# EAGLE design logger (EAGLE 4.16)
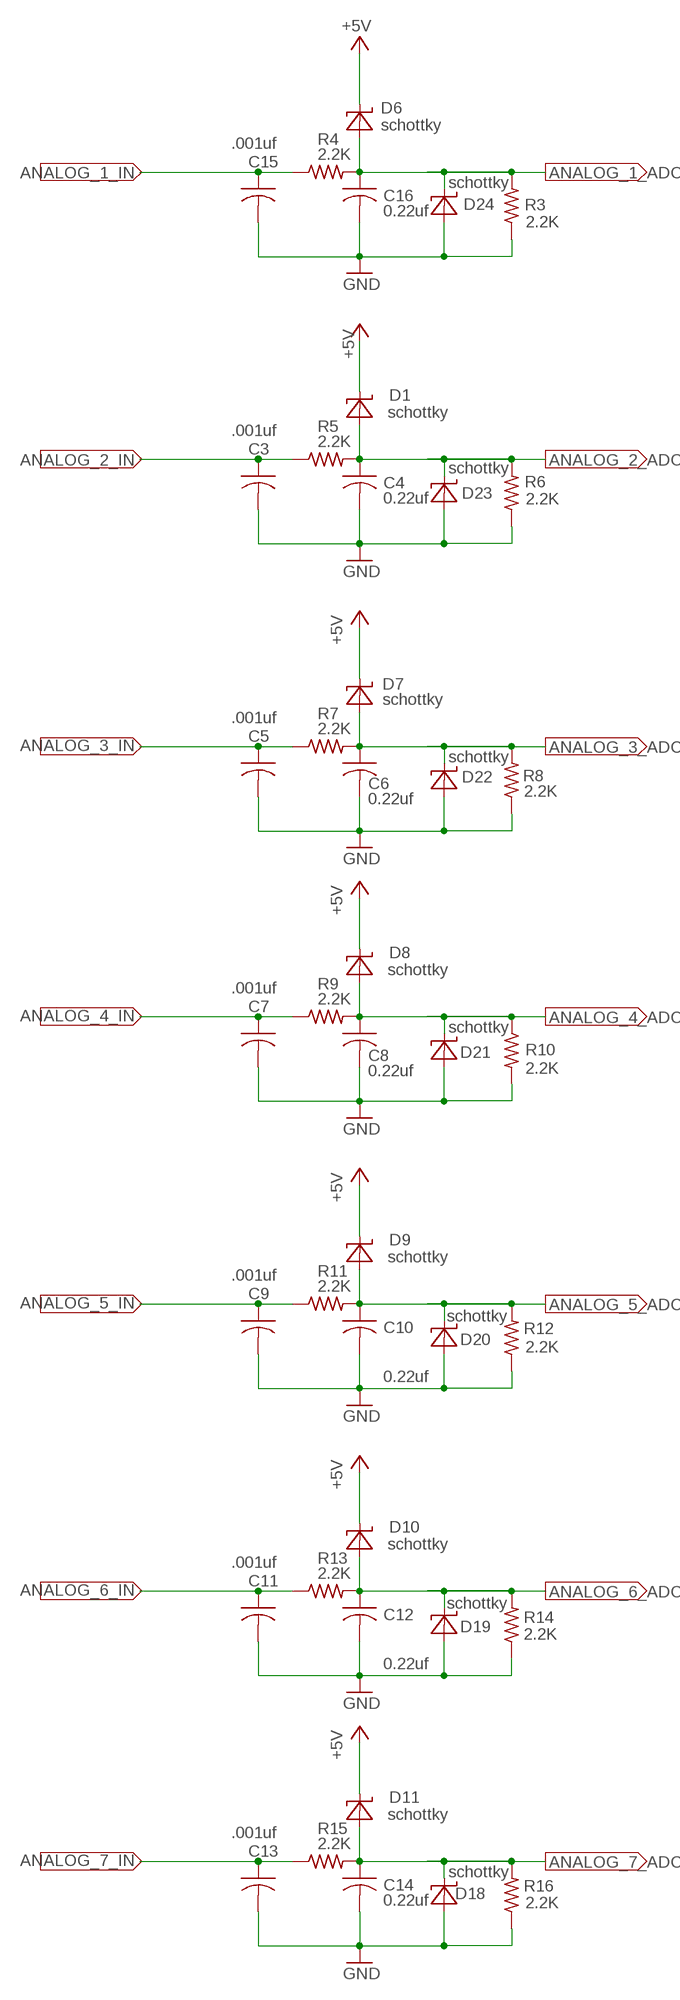
[diagram p0: schematic, sheet 1, part 1 of 2]
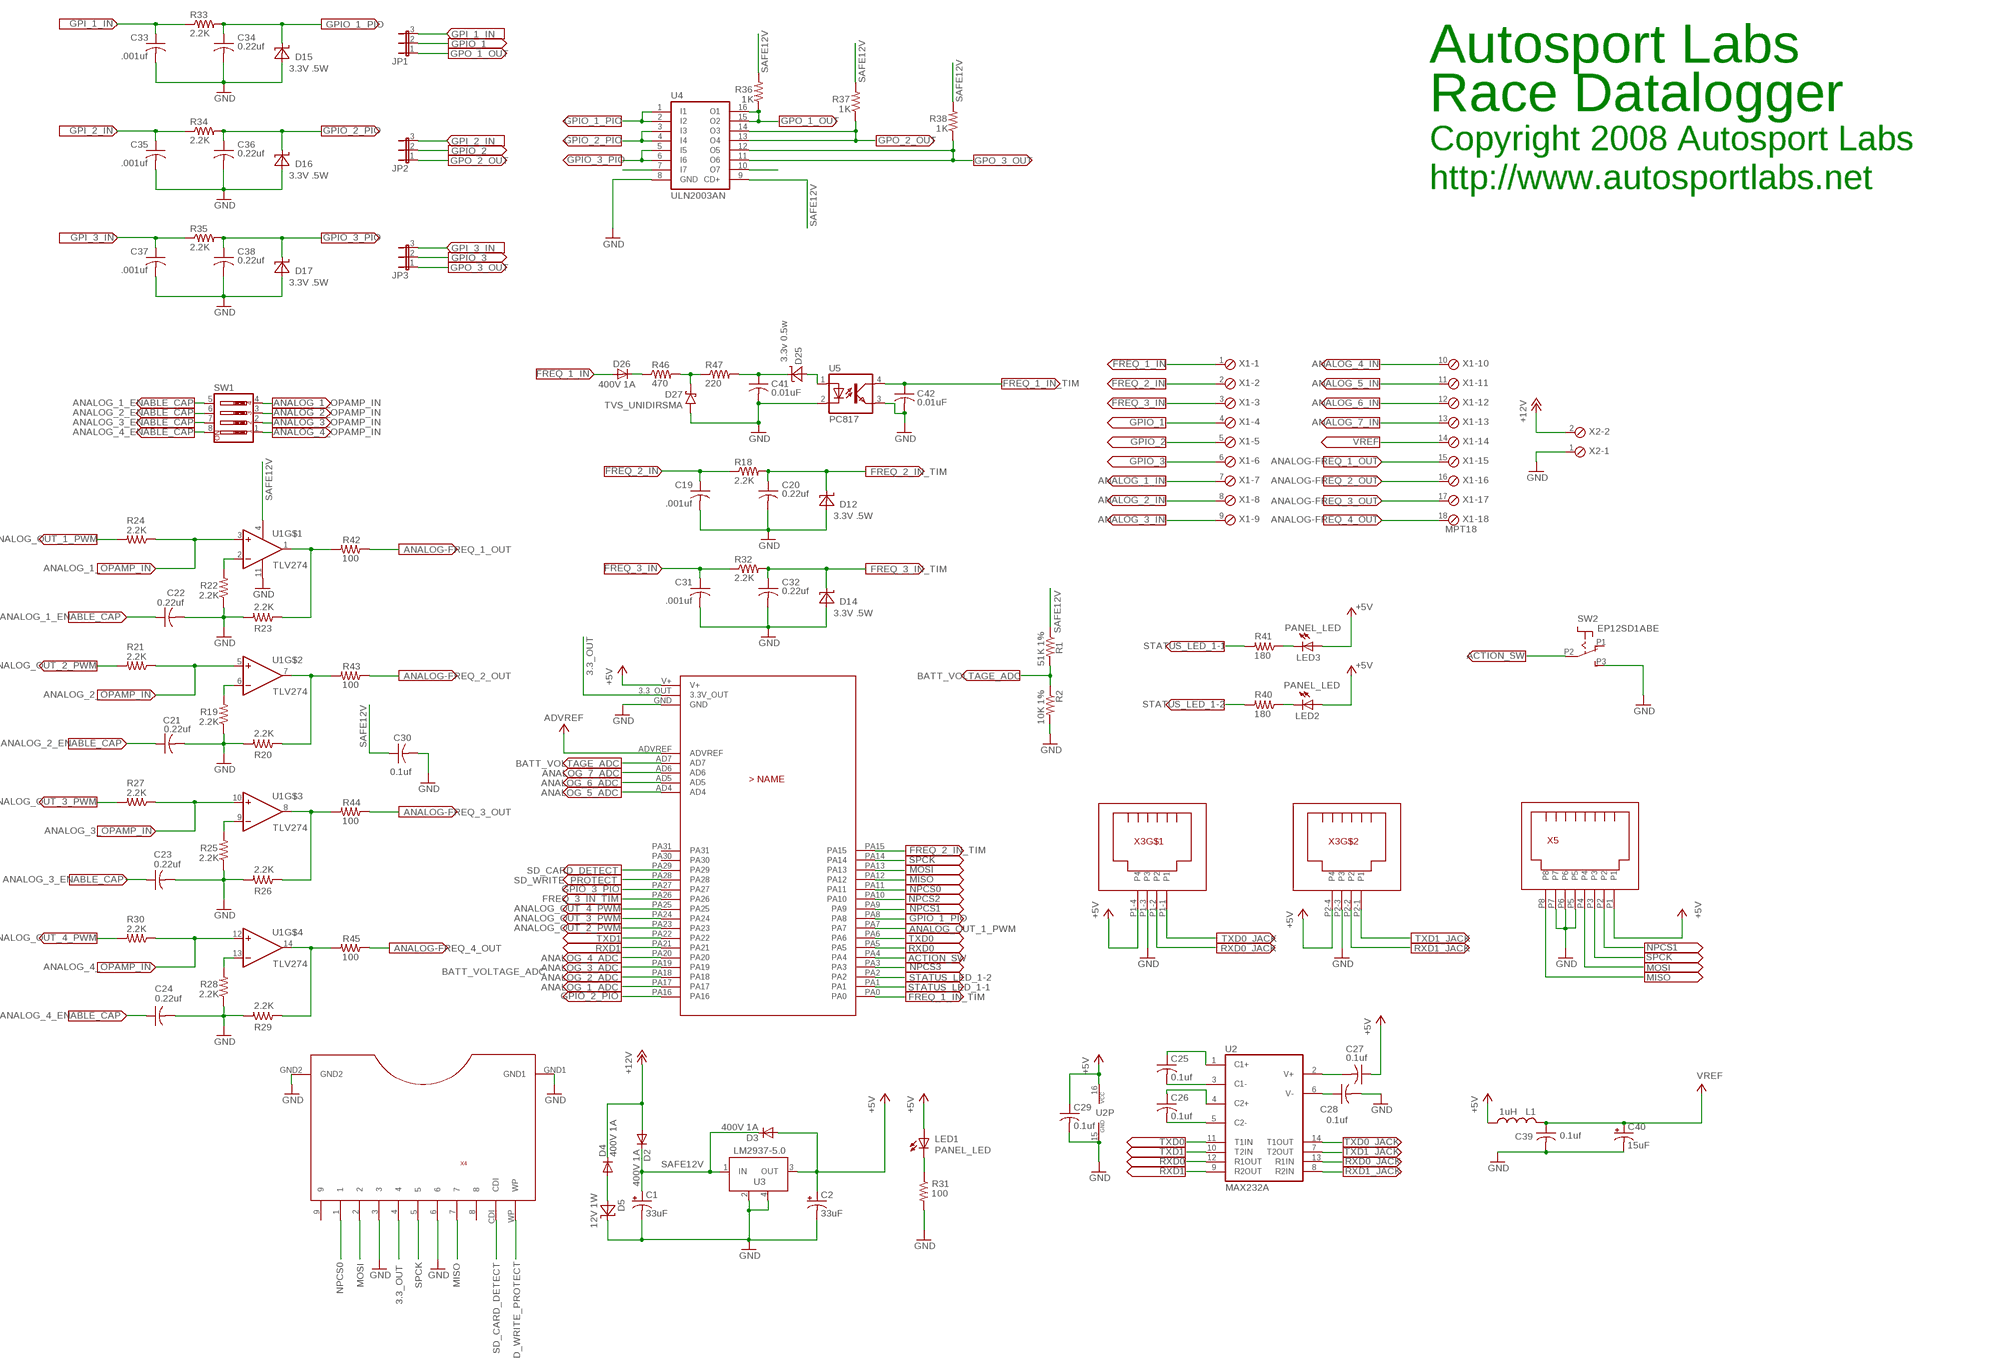
[diagram p1: schematic, sheet 1, part 2 of 2]

## Parts
C1  33uF  CPOL-US153CLV-0605  [153CLV-0605]
C2  33uF  CPOL-USSMCD  [SMC_D]
C3  .001uf  C-USC1206K  [C1206K]
C4  0.22uf  C-USC1206K  [C1206K]
C5  .001uf  C-USC1206K  [C1206K]
C6  0.22uf  C-USC1206K  [C1206K]
C7  .001uf  C-USC1206K  [C1206K]
C8  0.22uf  C-USC1206K  [C1206K]
C9  .001uf  C-USC1206K  [C1206K]
C10  0.22uf  C-USC1206K  [C1206K]
C11  .001uf  C-USC1206K  [C1206K]
C12  0.22uf  C-USC1206K  [C1206K]
C13  .001uf  C-USC1206K  [C1206K]
C14  0.22uf  C-USC1206K  [C1206K]
C15  .001uf  C-USC1206K  [C1206K]
C16  0.22uf  C-USC1206K  [C1206K]
C19  .001uf  C-USC1206K  [C1206K]
C20  0.22uf  C-USC1206K  [C1206K]
C21  0.22uf  C-USC1206K  [C1206K]
C22  0.22uf  C-USC1206K  [C1206K]
C23  0.22uf  C-USC1206K  [C1206K]
C24  0.22uf  C-USC1206K  [C1206K]
C25  0.1uf  C-USC1206K  [C1206K]
C26  0.1uf  C-USC1206K  [C1206K]
C27  0.1uf  C-USC1206K  [C1206K]
C28  0.1uf  C-USC1206K  [C1206K]
C29  0.1uf  C-USC1206K  [C1206K]
C30  0.1uf  C-USC1206K  [C1206K]
C31  .001uf  C-USC1206K  [C1206K]
C32  0.22uf  C-USC1206K  [C1206K]
C33  .001uf  C-USC1206K  [C1206K]
C34  0.22uf  C-USC1206K  [C1206K]
C35  .001uf  C-USC1206K  [C1206K]
C36  0.22uf  C-USC1206K  [C1206K]
C37  .001uf  C-USC1206K  [C1206K]
C38  0.22uf  C-USC1206K  [C1206K]
C39  0.1uf  C-USC1206K  [C1206K]
C40  15uF  CPOL-USSMCD  [SMC_D]
C41  0.01uF  C-USC1206K  [C1206K]
C42  0.01uF  C-USC1206K  [C1206K]
CPU_MODULE  CPU_MODULE  [CPU_MODULE]
D1  schottky  ZENER2  [SOD123]
D2  400V 1A  DIODE1  [SMA]
D3  400V 1A  DIODE1  [SMA]
D4  400V 1A  DIODE1  [SMA]
D5  12V 1W  ZENER2  [SOD123]
D6  schottky  ZENER2  [SOD123]
D7  schottky  ZENER2  [SOD123]
D8  schottky  ZENER2  [SOD123]
D9  schottky  ZENER2  [SOD123]
D10  schottky  ZENER2  [SOD123]
D11  schottky  ZENER2  [SOD123]
D12  3.3V .5W  ZENER2  [SOD123]
D14  3.3V .5W  ZENER2  [SOD123]
D15  3.3V .5W  ZENER2  [SOD123]
D16  3.3V .5W  ZENER2  [SOD123]
D17  3.3V .5W  ZENER2  [SOD123]
D18  schottky  ZENER2  [SOD123]
D19  schottky  ZENER2  [SOD123]
D20  schottky  ZENER2  [SOD123]
D21  schottky  ZENER2  [SOD123]
D22  schottky  ZENER2  [SOD123]
D23  schottky  ZENER2  [SOD123]
D24  schottky  ZENER2  [SOD123]
D25  3.3v 0.5w  ZENER2  [SOD123]
D26  400V 1A  DIODE1  [SMA]
D27  TVS_UNIDIRSMA  [SMA]
JP1  JP2E  [JP2]
JP2  JP2E  [JP2]
JP3  JP2E  [JP2]
L1  1uH  INDUCTOR  [1210]
LED1  PANEL_LED  [RIGHTANGLE_CML_5323F5]
LED2  PANEL_LED  [RIGHTANGLE_CML_5323F5]
LED3  PANEL_LED  [RIGHTANGLE_CML_5323F5]
R1  51K 1%  R-US_M1206  [M1206]
R2  10K 1%  R-US_M1206  [M1206]
R3  2.2K  R-US_M1206  [M1206]
R4  2.2K  R-US_M1206  [M1206]
R5  2.2K  R-US_M1206  [M1206]
R6  2.2K  R-US_M1206  [M1206]
R7  2.2K  R-US_M1206  [M1206]
R8  2.2K  R-US_M1206  [M1206]
R9  2.2K  R-US_M1206  [M1206]
R10  2.2K  R-US_M1206  [M1206]
R11  2.2K  R-US_M1206  [M1206]
R12  2.2K  R-US_M1206  [M1206]
R13  2.2K  R-US_M1206  [M1206]
R14  2.2K  R-US_M1206  [M1206]
R15  2.2K  R-US_M1206  [M1206]
R16  2.2K  R-US_M1206  [M1206]
R18  2.2K  R-US_M1206  [M1206]
R19  2.2K  R-US_M1206  [M1206]
R20  2.2K  R-US_M1206  [M1206]
R21  2.2K  R-US_M1206  [M1206]
R22  2.2K  R-US_M1206  [M1206]
R23  2.2K  R-US_M1206  [M1206]
R24  2.2K  R-US_M1206  [M1206]
R25  2.2K  R-US_M1206  [M1206]
R26  2.2K  R-US_M1206  [M1206]
R27  2.2K  R-US_M1206  [M1206]
R28  2.2K  R-US_M1206  [M1206]
R29  2.2K  R-US_M1206  [M1206]
R30  2.2K  R-US_M1206  [M1206]
R31  100  R-US_M1206  [M1206]
R32  2.2K  R-US_M1206  [M1206]
R33  2.2K  R-US_M1206  [M1206]
R34  2.2K  R-US_M1206  [M1206]
R35  2.2K  R-US_M1206  [M1206]
R36  1K  R-US_M1206  [M1206]
R37  1K  R-US_M1206  [M1206]
R38  1K  R-US_M1206  [M1206]
R40  180  R-US_M1206  [M1206]
R41  180  R-US_M1206  [M1206]
R42  100  R-US_M1206  [M1206]
R43  100  R-US_M1206  [M1206]
R44  100  R-US_M1206  [M1206]
R45  100  R-US_M1206  [M1206]
R46  470  R-US_M1206  [M1206]
R47  220  R-US_M1206  [M1206]
SW1  SW_DIP-4  [EDG-04]
SW2  EP12SD1ABE  [EP12SD1ABE]
U1  TLV274  [DIL14]
U2  MAX232A  MAX232  [DIL16]
U3  LM2937-5.0  LM2937  [SOT223]
U4  ULN2003AN  [DIL16]
U5  PC817  [DIL04]
X1  MPT18  [18POL35]
X2  MPT23.5MM  [2POL35]
X3  GENERIC_DUAL_RJ11  [DUAL_RJ11_RIGHT_ANGLE_PCB]
X4  3M-CARD_CONNECTOR_SD  [SD_CARD]
X5  RJ45_RIGHT_ANGLE  [RJ45_RIGHT_ANGLE_PCB]

## Nets
3.3_OUT: CPU_MODULE.3.3_OUT(3.3V_OUT) X4.4
+5V: C2.+ C27.1 C29.1 CPU_MODULE.V+ D1.C D3.A D6.C D7.C D8.C D9.C D10.C D11.C L1.1 LED1.A LED2.A LED3.A U2.16(VCC) U3.3(OUT) X3.P1-4(P4) X3.P2-4(P4) X5.P1
+12V: D2.A D4.C X2.2
ACTION_SW: CPU_MODULE.PA4 SW2.P2(P)
ADVREF: CPU_MODULE.ADVREF
ANALOG-FREQ_1_OPAMP_OUT: R23.1 R42.2 U1.1(OUT)
ANALOG-FREQ_1_OUT: R42.1 X1.15
ANALOG-FREQ_2_OPAMP_OUT: R20.1 R43.2 U1.7(OUT)
ANALOG-FREQ_2_OUT: R43.1 X1.16
ANALOG-FREQ_3_OPAMP_OUT: R26.1 R44.2 U1.8(OUT)
ANALOG-FREQ_3_OUT: R44.1 X1.17
ANALOG-FREQ_4_OPAMP_OUT: R29.1 R45.2 U1.14(OUT)
ANALOG-FREQ_4_OUT: R45.1 X1.18
ANALOG_1_ADC: C16.1 CPU_MODULE.PA17 D6.A D24.C R3.2 R4.2
ANALOG_1_ENABLE_CAP: C22.1 SW1.5
ANALOG_1_IN: C15.1 R4.1 X1.7
ANALOG_1_OPAMP_IN: R24.1 SW1.4 U1.3(+IN)
ANALOG_2_ADC: C4.1 CPU_MODULE.PA18 D1.A D23.C R5.2 R6.2
ANALOG_2_ENABLE_CAP: C21.1 SW1.6
ANALOG_2_IN: C3.1 R5.1 X1.8
ANALOG_2_OPAMP_IN: R21.1 SW1.3 U1.5(+IN)
ANALOG_3_ADC: C6.1 CPU_MODULE.PA19 D7.A D22.C R7.2 R8.2
ANALOG_3_ENABLE_CAP: C23.1 SW1.7
ANALOG_3_IN: C5.1 R7.1 X1.9
ANALOG_3_OPAMP_IN: R27.1 SW1.2 U1.10(+IN)
ANALOG_4_ADC: C8.1 CPU_MODULE.PA20 D8.A D21.C R9.2 R10.1
ANALOG_4_ENABLE_CAP: C24.1 SW1.8
ANALOG_4_IN: C7.1 R9.1 X1.10
ANALOG_4_OPAMP_IN: R30.1 SW1.1 U1.12(+IN)
ANALOG_5_ADC: C10.1 CPU_MODULE.AD4 D9.A D20.C R11.2 R12.2
ANALOG_5_IN: C9.1 R11.1 X1.11
ANALOG_6_ADC: C12.1 CPU_MODULE.AD5 D10.A D19.C R13.2 R14.2
ANALOG_6_IN: C11.1 R13.1 X1.12
ANALOG_7_ADC: C14.1 CPU_MODULE.AD6 D11.A D18.C R15.2 R16.2
ANALOG_7_IN: C13.1 R15.1 X1.13
ANALOG_OUT_1_PWM: CPU_MODULE.PA7 R24.2
ANALOG_OUT_2_PWM: CPU_MODULE.PA23 R21.2
ANALOG_OUT_3_PWM: CPU_MODULE.PA24 R27.2
ANALOG_OUT_4_PWM: CPU_MODULE.PA25 R30.2
BATT_VOLTAGE_ADC: CPU_MODULE.AD7 R1.2 R2.1
FREQ_1_IN: D26.A X1.1
FREQ_1_IN_TIM: C42.1 CPU_MODULE.PA0 U5.4(COL)
FREQ_2_IN: C19.1 R18.1 X1.2
FREQ_2_IN_TIM: C20.1 CPU_MODULE.PA15 D12.C R18.2
FREQ_3_IN: C31.1 R32.1 X1.3
FREQ_3_IN_TIM: C32.1 CPU_MODULE.PA26 D14.C R32.2
GND: C1.- C2.- C3.2 C4.2 C5.2 C6.2 C7.2 C8.2 C9.2 C10.2 C11.2 C12.2 C13.2 C14.2 C15.2 C16.2 C19.2 C20.2 C21.2 C22.2 C23.2 C24.2 C28.2 C29.2 C30.2 C31.2 C32.2 C33.2 C34.2 C35.2 C36.2 C37.2 C38.2 C39.2 C40.- C41.2 C42.2 CPU_MODULE.GND D5.C D12.A D14.A D15.A D16.A D17.A D18.A D19.A D20.A D21.A D22.A D23.A D24.A D27.A R2.2 R3.1 R6.1 R8.1 R10.2 R12.1 R14.1 R16.1 R19.1 R20.2 R22.1 R23.2 R25.1 R26.2 R28.1 R29.2 R31.2 SW2.P3(S) U1.11(V-) U2.15(GND) U3.2(GND) U3.4(GND_TAB) U4.8(GND) U5.2(C) U5.3(EMIT) X2.1 X3.P1-3(P3) X3.P2-3(P3) X4.3 X4.6 X4.GND1 X4.GND2 X5.P5 X5.P6 X5.P7
GPI_1_IN: C33.1 JP1.3 R33.1
GPI_2_IN: C35.1 JP2.3 R34.1
GPI_3_IN: C37.1 JP3.3 R35.1
GPIO_1: JP1.2 X1.4
GPIO_1_PIO: C34.1 CPU_MODULE.PA8 D15.C R33.2 U4.1(I1) U4.2(I2)
GPIO_2: JP2.2 X1.5
GPIO_2_PIO: C36.1 CPU_MODULE.PA16 D16.C R34.2 U4.3(I3) U4.4(I4)
GPIO_3: JP3.2 X1.6
GPIO_3_PIO: C38.1 CPU_MODULE.PA27 D17.C R35.2 U4.5(I5) U4.6(I6)
GPO_1_OUT: JP1.1 R36.1 U4.15(O2) U4.16(O1)
GPO_2_OUT: JP2.1 R37.1 U4.13(O4) U4.14(O3)
GPO_3_OUT: JP3.1 R38.1 U4.11(O6) U4.12(O5)
MISO: CPU_MODULE.PA12 X4.7 X5.P8
MOSI: CPU_MODULE.PA13 X4.2 X5.P4
N$3: D27.C R46.2 R47.1
N$4: D26.C R46.1
N$5: D4.A D5.A
N$6: C41.1 D25.C R47.2
N$7: LED3.C R41.1
N$8: R19.2 U1.6(-IN)
N$9: LED2.C R40.1
N$10: R22.2 U1.2(-IN)
N$12: R25.2 U1.9(-IN)
N$14: R28.2 U1.13(-IN)
N$15: D25.A U5.1(A)
N$16: C25.1 U2.1(C1+)
N$17: C25.2 U2.3(C1-)
N$18: C26.1 U2.4(C2+)
N$19: C26.2 U2.5(C2-)
N$20: C27.2 U2.2(V+)
N$21: C28.1 U2.6(V-)
N$22: LED1.C R31.1
N$30: U4.10(O7)
N$37: U4.7(I7)
NPCS0: CPU_MODULE.PA11 X4.1
NPCS1: CPU_MODULE.PA9 X5.P2
NPCS2: CPU_MODULE.PA10
NPCS3: CPU_MODULE.PA3
RXD0: CPU_MODULE.PA5 U2.12(R1OUT)
RXD0_JACK: U2.13(R1IN) X3.P1-2(P2)
RXD1: CPU_MODULE.PA21 U2.9(R2OUT)
RXD1_JACK: U2.8(R2IN) X3.P2-2(P2)
SAFE12V: C1.+ C30.1 D2.C D3.C R1.1 R36.2 R37.2 R38.2 U1.4(V+) U3.1(IN) U4.9(CD+)
SD_CARD_DETECT: CPU_MODULE.PA29 X4.CDI
SD_WRITE_PROTECT: CPU_MODULE.PA28 X4.WP
SPCK: CPU_MODULE.PA14 X4.5 X5.P3
STATUS_LED_1-1: CPU_MODULE.PA1 R41.2
STATUS_LED_1-2: CPU_MODULE.PA2 R40.2
TXD0: CPU_MODULE.PA6 U2.11(T1IN)
TXD0_JACK: U2.14(T1OUT) X3.P1-1(P1)
TXD1: CPU_MODULE.PA22 U2.10(T2IN)
TXD1_JACK: U2.7(T2OUT) X3.P2-1(P1)
VREF: C39.1 C40.+ L1.2 X1.14
Unconnected: CPU_MODULE.PA30 CPU_MODULE.PA31 SW2.P1(O) X4.8 X4.9

## Notes on the sheet
- Autosport Labs
- Race Datalogger
- Copyright 2008 Autosport Labs
- http://www.autosportlabs.net

## Library data of the parts
C1 C2 C40 = rcl:CPOL-US: POLARIZED CAPACITOR, American symbol
C3-C16 C19-C39 C41 C42 = rcl:C-US: CAPACITOR, American symbol
CPU_MODULE = cpu_module:CPU_MODULE
D1 D5-D12 D14-D25 = smt_diodes:ZENER
D2-D4 D26 = smt_diodes:DIODE
D27 = smt_diodes:TVS_UNIDIR
JP1-JP3 = jumper:JP2E: JUMPER
L1 = smt_inductors:INDUCTOR
LED1-LED3 = LEDs:PANEL_LED
R1-R16 R18-R38 R40-R47 = rcl:R-US_: RESISTOR, American symbol
SW1 = special:SW_DIP-4: DIP SWITCH
SW2 = misc_switch:EP12SD1ABE
U1 = op_amps:TLV274
U2 = maxim:MAX232: RS232 TRANSEIVER
U3 = voltage_regulators:LM2937
U4 = uln-udn:ULN2003A: DRIVER ARRAY
U5 = optocoupler:PC817: SHARP OPTO COUPLER
X1 = pluggable_terminal_blocks:MPT18
X2 = pluggable_terminal_blocks:MPT2: PHOENIX CONNECTOR
X3 = FCI_RJ12:GENERIC_DUAL_RJ11
X4 = 3m_sd_card:3M-CARD_CONNECTOR_SD
X5 = FCI_RJ12:RJ45_RIGHT_ANGLE

## Board
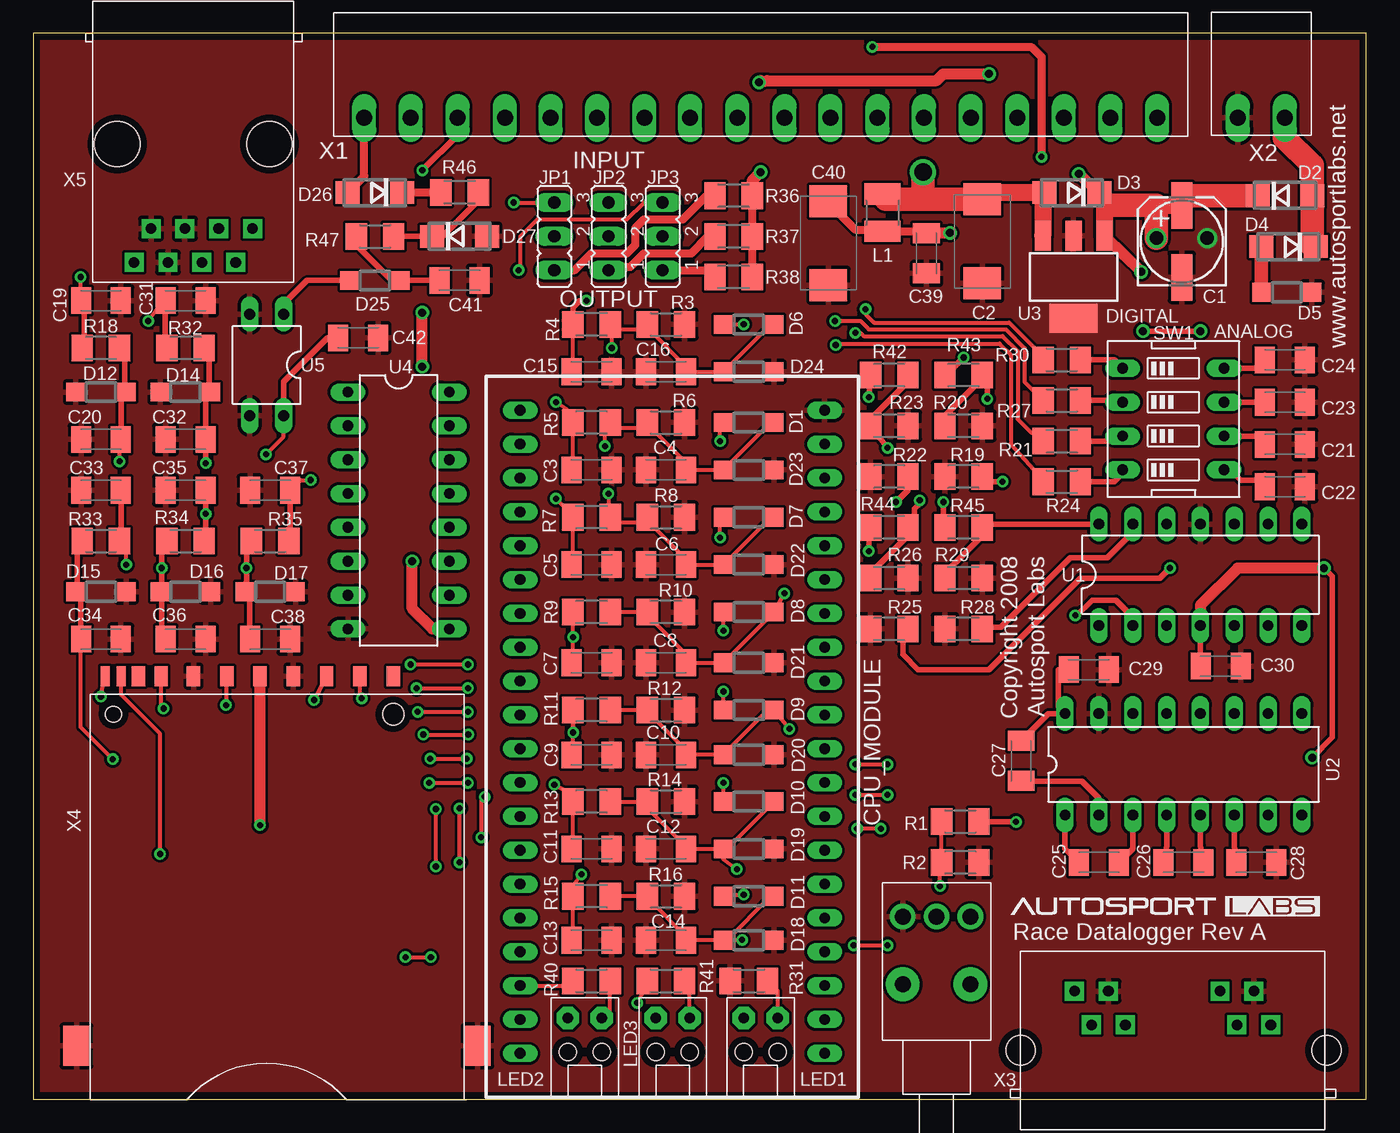
[diagram p2: board, top side]
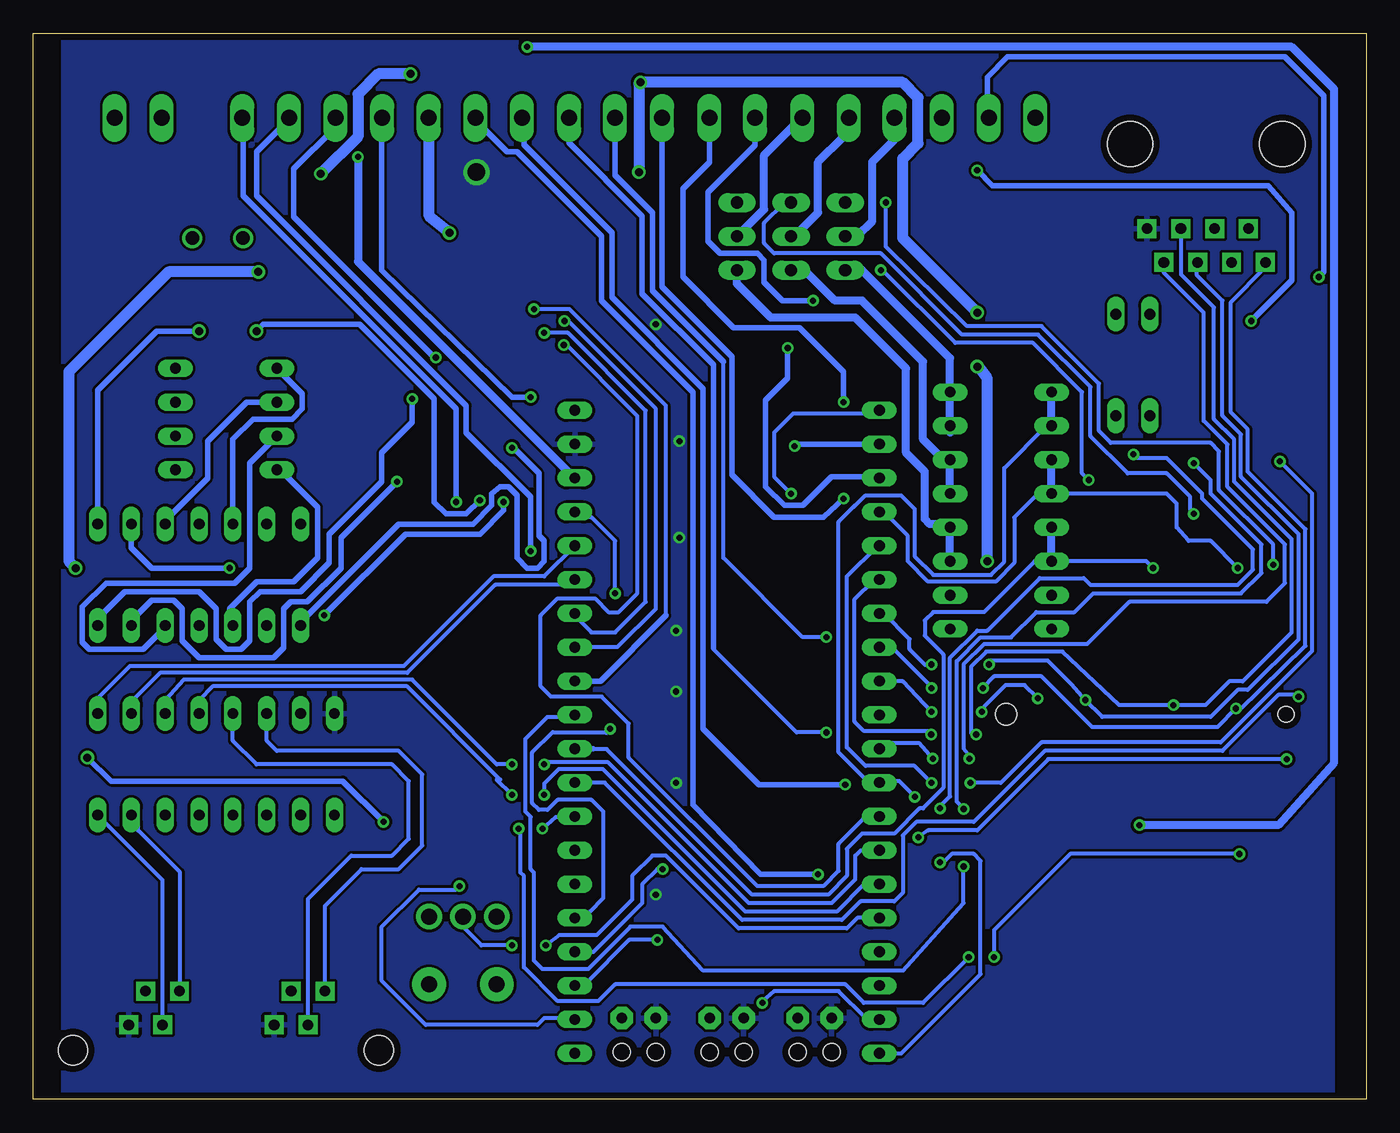
[diagram p3: board, bottom side, seen from below]

Size 100.08 x 80.01 mm. Coordinates in mm from the lower left corner, seen from the top.
Outline: 0,0 100.08,0 100.08,80.01 0,80.01 0,0
Copper layers (1*16): Top 0.035mm / dielectric 1.5mm / Bottom 0.035mm
Design rules "default": minimum track width 10mil, minimum drill 17mil, track to track 8mil, track to pad 8mil, pad to pad 8mil, via to via 8mil, smd to smd 8mil, copper to edge 20mil, drill to drill 8mil, minimum pad ring 10mil, minimum via ring 8mil, stop-mask expansion 4mil, vias tented up to drill 24mil, thermal gap 10mil

### Footprints (pad centres in the part's own frame; a part is rotated, then mirrored left to right if it is on the bottom)
153CLV-0605 = smd 3.5 x 1.6: + 2.7,0; - -2.7,0
SMC_D = smd 2.4 x 2.8: + -3.15,0; - 3.15,0
C1206K = smd 1.5 x 2: 1 -1.5,0; 2 1.5,0
CPU_MODULE = drill 0.8 long: 3.3_OUT -20.32,12.7; AD4 12.7,12.7; AD5 15.24,12.7; AD6 17.78,12.7; AD7 20.32,12.7; ADVREF 22.86,12.7; GND -25.4,12.7; PA0 22.86,-10.16; PA1 20.32,-10.16; PA2 17.78,-10.16; PA3 15.24,-10.16; PA4 12.7,-10.16; PA5 10.16,-10.16; PA6 7.62,-10.16; PA7 5.08,-10.16; PA8 2.54,-10.16; PA9 0,-10.16; PA10 -2.54,-10.16; PA11 -5.08,-10.16; PA12 -7.62,-10.16; PA13 -10.16,-10.16; PA14 -12.7,-10.16; PA15 -15.24,-10.16; PA16 -17.78,-10.16; PA17 -20.32,-10.16; PA18 -22.86,-10.16; PA19 -25.4,-10.16; PA20 -17.78,12.7; PA21 -15.24,12.7; PA22 -12.7,12.7; PA23 -10.16,12.7; PA24 -7.62,12.7; PA25 -5.08,12.7; PA26 -2.54,12.7; PA27 0,12.7; PA28 2.54,12.7; PA29 5.08,12.7; PA30 7.62,12.7; PA31 10.16,12.7; V+ -22.86,12.7
SOD123 = smd 1.4 x 1.4: A 1.9,0; C -1.9,0
SMA = smd 1.8 x 1.7: A 2.05,0; C -2.05,0
JP2 = drill 0.914 long: 1 -2.54,0; 2 0,0; 3 2.54,0
1210 = smd 1.6 x 2.7: 1 -1.4,0; 2 1.4,0
RIGHTANGLE_CML_5323F5 = drill 0.8 pad 1.676 octagon: A -1.27,1.651; C 1.27,1.651 | hole 1.295: 1.27,-0.889; -1.27,-0.889
M1206 = smd 1.6 x 2: 1 -1.4,0; 2 1.4,0
EDG-04 = drill 0.813 long: 1 -3.81,-3.81; 2 -1.27,-3.81; 3 1.27,-3.81; 4 3.81,-3.81; 5 3.81,3.81; 6 1.27,3.81; 7 -1.27,3.81; 8 -3.81,3.81
EP12SD1ABE = drill 1.194 pad 2.54 round: BRACKET1 -2.54,-5.08; BRACKET2 2.54,-5.08 | drill 1.194 pad 1.93 round: P1 2.54,0; P2 0,0; P3 -2.54,0
DIL14 = drill 0.813 long: 1 -7.62,-3.81; 2 -5.08,-3.81; 3 -2.54,-3.81; 4 0,-3.81; 5 2.54,-3.81; 6 5.08,-3.81; 7 7.62,-3.81; 8 7.62,3.81; 9 5.08,3.81; 10 2.54,3.81; 11 0,3.81; 12 -2.54,3.81; 13 -5.08,3.81; 14 -7.62,3.81
DIL16 = drill 0.813 long: 1 -8.89,-3.81; 2 -6.35,-3.81; 3 -3.81,-3.81; 4 -1.27,-3.81; 5 1.27,-3.81; 6 3.81,-3.81; 7 6.35,-3.81; 8 8.89,-3.81; 9 8.89,3.81; 10 6.35,3.81; 11 3.81,3.81; 12 1.27,3.81; 13 -1.27,3.81; 14 -3.81,3.81; 15 -6.35,3.81; 16 -8.89,3.81
SOT223 = smd 1.219 x 2.235: 1 -2.311,-3.099; 2 0,-3.099; 3 2.311,-3.099 | smd 3.6 x 2.2: 4 0,3.099
DIL04 = drill 0.813 long: 1 -1.27,-3.81; 2 1.27,-3.81; 3 1.27,3.81; 4 -1.27,3.81
18POL35 = drill 1.2 long: 1 -29.77,0; 2 -26.28,0; 3 -22.74,0; 4 -19.2,0; 5 -15.76,0; 6 -12.27,0; 7 -8.73,0; 8 -5.29,0; 9 -1.75,0; 10 1.79,0; 11 5.23,0; 12 8.77,0; 13 12.27,0; 14 15.77,0; 15 19.27,0; 16 22.77,0; 17 26.27,0; 18 29.77,0
2POL35 = drill 1.2 long: 1 -1.76,0; 2 1.77,0
DUAL_RJ11_RIGHT_ANGLE_PCB = drill 0.8 pad 1.422 square: P1-1 4.064,10.414; P1-2 5.334,7.874; P1-3 6.604,10.414; P1-4 7.874,7.874; P2-1 14.986,10.414; P2-2 16.256,7.874; P2-3 17.526,10.414; P2-4 18.796,7.874 | hole 2.2: 22.987,5.969; 0,5.969
SD_CARD = smd 1 x 1.5: 1 7,2.8; 2 4.5,2.8; 3 2,2.8; 4 -0.5,2.8; 5 -3,2.8; 6 -5.5,2.8; 7 -7.93,2.8; 8 -9.63,2.8; 9 9.5,2.8 | smd 0.7 x 1.5: CDI -10.93,2.8; WP -12.13,2.8 | smd 2 x 3: GND1 -14.28,-24.95; GND2 15.82,-24.95 | hole 1.6: 9.5,-0.05 | hole 1.2: -11.5,-0.05
RJ45_RIGHT_ANGLE_PCB = drill 0.8 pad 1.422 square: P1 3.099,17.069; P2 4.369,19.609; P3 5.639,17.069; P4 6.909,19.609; P5 8.179,17.069; P6 9.449,19.609; P7 10.719,17.069; P8 11.989,19.609 | hole 3.404: 1.829,10.719; 13.259,10.719

### Placement (x,y rotation side)
C1  86.23,64.39 90 top
C2  71.25,64.39 270 top
C3  41.91,47.24 0 top
C4  47.5,47.24 180 top
C5  41.91,40.13 0 top
C6  47.5,40.13 180 top
C7  41.91,32.77 0 top
C8  47.5,32.77 180 top
C9  41.91,25.86 0 top
C10  47.5,25.86 180 top
C11  41.91,18.8 0 top
C12  47.5,18.8 180 top
C13  41.91,11.94 0 top
C14  47.5,11.94 180 top
C15  41.91,54.61 0 top
C16  47.5,54.61 180 top
C19  5.08,59.94 0 top
C20  5.08,49.53 180 top
C21  93.98,49.15 0 top
C22  93.98,45.97 0 top
C23  93.98,52.32 0 top
C24  93.98,55.5 0 top
C25  80.01,17.78 0 top
C26  86.36,17.78 0 top
C27  74.17,25.4 270 top
C28  91.82,17.78 0 top
C29  79.25,32.26 0 top
C30  89.15,32.51 0 top
C31  11.43,59.94 0 top
C32  11.43,49.53 180 top
C33  5.08,45.72 180 top
C34  5.08,34.54 0 top
C35  11.43,45.72 180 top
C36  11.43,34.54 0 top
C37  17.78,45.72 180 top
C38  17.78,34.54 0 top
C39  67.06,63.5 270 top
C40  59.69,64.26 270 top
C41  32,61.47 0 top
C42  24.38,57.15 0 top
CPU_MODULE  46.71,26.31 270 top
D1  53.72,50.8 0 top
D2  93.98,67.82 0 top
D3  77.98,68.07 180 top
D4  94.23,64.01 180 top
D5  94.11,60.58 180 top
D6  53.72,58.17 0 top
D7  53.72,43.69 0 top
D8  53.72,36.58 0 top
D9  53.72,29.21 0 top
D10  53.72,22.35 0 top
D11  53.72,15.24 0 top
D12  5.08,53.09 180 top
D14  11.43,53.09 180 top
D15  5.08,38.1 0 top
D16  11.43,38.1 0 top
D17  17.78,38.1 0 top
D18  53.72,11.94 0 top
D19  53.72,18.8 0 top
D20  53.72,25.86 0 top
D21  53.72,32.77 0 top
D22  53.72,40.13 0 top
D23  53.72,47.24 0 top
D24  53.72,54.61 0 top
D25  25.65,61.47 180 top
D26  25.65,68.07 180 top
D27  32,64.77 0 top
JP1  39.12,64.77 90 top
JP2  43.18,64.77 90 top
JP3  47.24,64.77 90 top
L1  63.75,66.55 270 top
LED1  54.61,4.45 0 top
LED2  41.4,4.45 0 top
LED3  48.01,4.45 0 top
R1  69.6,20.85 180 top
R2  69.6,17.78 0 top
R3  47.5,58.17 180 top
R4  41.91,58.17 0 top
R5  41.91,50.8 0 top
R6  47.5,50.8 180 top
R7  41.91,43.69 0 top
R8  47.5,43.69 180 top
R9  41.91,36.58 0 top
R10  47.5,36.58 0 top
R11  41.91,29.21 0 top
R12  47.5,29.21 180 top
R13  41.91,22.35 0 top
R14  47.5,22.35 180 top
R15  41.91,15.24 0 top
R16  47.5,15.24 180 top
R18  5.08,56.39 0 top
R19  69.85,46.74 0 top
R20  69.85,50.55 0 top
R21  77.22,49.4 180 top
R22  64.26,46.74 0 top
R23  64.26,50.55 0 top
R24  77.22,46.35 180 top
R25  64.26,35.31 0 top
R26  64.26,39.12 0 top
R27  77.22,52.45 180 top
R28  69.85,35.31 0 top
R29  69.85,39.12 0 top
R30  77.22,55.5 180 top
R31  53.72,8.89 180 top
R32  11.43,56.39 0 top
R33  5.08,41.91 180 top
R34  11.43,41.91 180 top
R35  17.78,41.91 180 top
R36  52.58,67.82 0 top
R37  52.58,64.77 0 top
R38  52.58,61.72 0 top
R40  41.91,8.89 180 top
R41  47.5,8.89 180 top
R42  64.26,54.36 0 top
R43  69.85,54.36 0 top
R44  64.26,42.93 0 top
R45  69.85,42.93 0 top
R46  32,68.07 0 top
R47  25.65,64.77 180 top
SW1  85.6,51.05 270 top
SW2  67.82,13.72 0 top
U1  87.63,39.37 0 top
U2  86.36,25.15 0 top
U3  78.11,61.72 180 top
U4  27.43,44.2 270 top
U5  17.53,55.12 180 top
X1  54.61,73.66 0 top
X2  92.2,73.66 0 top
X3  74.12,-2.29 0 top
X4  17.53,28.96 0 top
X5  19.56,82.42 180 top

### Tracks (layer width: path | path; a pad name or v marks a point on that pad's centre or on a via)
3.3_OUT  (via drill 0.46)
  Top 0.61: v75.69,70.74 75.69,78.23 74.93,78.99 v62.99,78.99
  Top 0.813: X4.4 17.03,20.58 v17.02,20.57
  Bottom 0.61: v17.02,20.57 6.6,20.57 2.41,25.27 2.41,75.82 5.59,78.99 v62.99,78.99 | v75.69,70.74 75.69,62.87 59.56,46.74 59.31,46.74 59.44,46.66 CPU_MODULE.3.3_OUT
+5V  (via drill 0.46, 1.3)
  Top 0.305: D11.C 51.82,15.36 v53.34,15.37 | 51.82,24 v51.82,23.75 D10.C | D9.C v51.82,30.61 | D8.C 51.82,35.06 v51.82,35.18 | D7.C 51.56,43.43 v51.56,42.16 | D1.C 51.56,50.54 v51.56,49.4 | D6.C v53.34,58.17
  Top 0.406: C29.1 76.96,32.23 76.96,29.46 U2.16 76.22,28.96 C27.1
  Top 1.27: U3.3 75.79,67.92 75.95,68.07 D3.A 71.63,68.07 71.12,67.56 71.14,67.54 C2.+ | L1.1 63.75,67.82 64.01,67.56
  Top 1.778: 64.01,67.56 66.8,67.56 | 66.8,67.56 71.12,67.56 | 66.8,67.56 v66.8,69.6
  pour Bottom: 2.54,79.5 2.54,0.51 97.79,0.51 97.79,79.5
+12V
  Top 1.27: D4.C 96.01,64.01 96.03,64.03 | D2.A 96.01,67.82 | 93.93,73.7 93.93,73.97 | 93.93,73.7 X2.2 | 93.93,72.19 93.93,73.7
  Top 1.778: 96.03,64.03 D2.A | 96.01,67.82 96.01,70.1 93.93,72.19
ACTION_SW  (via drill 0.46)
  Top 0.305: v61.59,11.56 v64.14,11.56
  Bottom 0.305: CPU_MODULE.PA4 38.2,13.61 38.99,12.83 47.12,12.83 52.58,18.29 53.59,18.29 55.12,16.76 55.12,14.99 57.78,12.32 60.58,12.32 v61.59,11.56 | v64.14,11.56 66.42,11.56 67.82,12.95 SW2.P2
ANALOG-FREQ_1_OPAMP_OUT  (via drill 0.46)
  Top 0.406: R23.1 62.74,50.55 | R42.2 65.66,53.85 62.87,51.05 | R23.1 62.61,51.3 62.87,51.05 | R23.1 62.87,51.05 | 62.87,51.05 62.36,51.05 | R23.1 62.87,50.67 | R23.1 | v64.14,48.9 R23.1
  Bottom 0.406: U1.1 80.01,35.81 72.64,43.18 67.06,43.18 65.66,44.58 65.66,45.47 65.02,45.97 64.39,45.97 63.75,45.34 63.75,40.64 62.99,39.88 62.23,39.88 61.72,40.39 61.72,41.91 62.1,42.29 62.1,46.99 64.01,48.9 v64.14,48.9
ANALOG-FREQ_1_OUT  (via drill 0.46)
  Top 0.406: R42.1 62.48,54.36 | 62.99,54.61 62.99,54.36 R42.1 | R42.1 62.87,54.23 v62.74,52.7
  Bottom 0.406: X1.15 73.91,73.66 73.91,62.23 64.14,52.7 v62.74,52.7
ANALOG-FREQ_2_OPAMP_OUT  (via drill 0.46)
  Top 0.406: R20.1 68.2,50.8 68.07,50.93 71,53.85 R43.2 70.99,54.36 71.63,53.72 v71.63,52.58
  Bottom 0.406: U1.7 95.25,36.07 93.22,38.1 87.63,38.1 86.36,36.83 86.36,34.54 85.6,33.78 84.45,33.78 83.82,34.42 83.82,37.34 83.06,38.1 80.01,38.1 77.85,40.26 77.85,42.42 73.91,46.35 73.91,48.51 71.63,50.8 v71.63,52.58
ANALOG-FREQ_2_OUT  (via drill 0.46)
  Top 0.406: 68.71,54.61 R43.1 68.45,54.48 68.71,54.23 68.76,54.59 v69.85,55.68
  Bottom 0.406: v69.85,55.68 69.98,55.7 80.52,66.24 80.52,69.85 77.47,72.9 77.47,73.91 77.38,73.82 X1.16 77.47,73.66
ANALOG-FREQ_3_OPAMP_OUT  (via drill 0.46, 0.6)
  Top 0.406: 65.66,43.69 65.41,43.05 65.53,42.93 | R26.1 62.61,39.24 65.41,42.04 65.41,42.16 | 65.41,42.16 R44.2 65.53,42.93 | 65.41,42.16 65.53,42.16 | v83.31,57.66 v87.63,57.66 | v66.55,44.96 66.67,44.83 66.17,44.32 66.17,43.56 65.53,42.93
  Bottom 0.406: v83.31,57.66 82.8,58.17 75.56,58.17 69.98,52.58 69.98,44.83 69.09,43.94 67.56,43.94 v66.55,44.96 | U1.8 95.25,53.21 90.81,57.66 v87.63,57.66
ANALOG-FREQ_3_OUT  (via drill 0.46)
  Top 0.406: R44.1 62.74,42.93 v62.74,41.15
  Bottom 0.406: v62.74,41.15 62.74,45.21 67.56,50.04 67.56,52.07 83.31,67.82 83.31,71.12 80.77,73.66 X1.17
ANALOG-FREQ_4_OPAMP_OUT
  Top 0.406: U1.14 71.12,43.18 71,43.06 R45.2 71,42.04 68.07,39.12 R29.1
ANALOG-FREQ_4_OUT  (via drill 0.46)
  Top 0.406: R45.1 68.07,42.93 68.33,43.18 v68.33,44.83
  Bottom 0.406: v68.33,44.83 68.33,51.82 84.33,67.82 84.33,73.66 X1.18
ANALOG_1_ADC  (via drill 0.46)
  Top 0.305: 49.02,54.61 C16.1 | 49.02,54.61 49.02,54.99 46.23,57.78 R3.2 45.72,57.78 43.56,57.78 R4.2 43.18,58.17 43.43,57.91 v43.43,56.39 | D24.C 55.37,58.17 D6.A | D24.C 52.07,54.61 | 49.02,54.61 D24.C
  Bottom 0.406: CPU_MODULE.PA17 36.55,46.71 36.58,46.74 40.13,46.74 42.29,44.58 43.69,44.58 45.09,45.97 45.09,52.45 43.43,54.1 v43.43,56.39
ANALOG_1_ENABLE_CAP
  Top 0.406: C22.1 92.46,46.48 | C22.1 92.48,46.84 | SW1.5 89.92,47.24 90.68,46.48 92.2,46.48 92.71,45.97 C22.1
ANALOG_1_IN  (via drill 0.46)
  Top 0.305: C15.1 40.39,54.61 40.51,54.73 R4.1 40.51,58.29
  Top 0.406: 40.51,58.29 40.51,59.43 41.02,59.94 v41.53,59.94
  Bottom 0.406: v41.53,59.94 43.81,59.94 45.21,61.34 45.21,62.99 45.72,63.5 48.51,63.5 49.4,64.39 49.4,68.07 45.88,71.59 X1.7
ANALOG_1_OPAMP_IN
  Top 0.406: 78.49,46.48 R24.1 81.15,46.35 82.04,47.24 SW1.4
  Bottom 0.406: SW1.4 81.53,47.24 78.74,44.45 78.74,40.64 80.52,38.86 83.31,38.86 85.34,36.83 U1.3
ANALOG_2_ADC  (via drill 0.46)
  Top 0.305: D1.A 55.37,50.8 D23.C C4.1 49,47.35 49.15,47.62 46.23,50.55 R6.2 45.72,50.42 43.56,50.42 R5.2 43.18,50.8 42.93,50.55 v42.93,49.02
  Bottom 0.406: CPU_MODULE.PA18 42.82,49.17 v42.93,49.02
ANALOG_2_ENABLE_CAP
  Top 0.406: C21.1 92.46,49.66 92.33,49.78 SW1.6
ANALOG_2_IN  (via drill 0.46)
  Top 0.305: C3.1 40.39,47.24 40.51,47.37 R5.1 | R5.1 40.51,51.56 | R5.1 40.89,51.18 v39.24,52.32
  Bottom 0.406: X1.8 49.32,70.31 51.31,68.33 51.31,61.72 47.5,57.91 42.55,57.91 39.24,54.61 v39.24,52.32
ANALOG_2_OPAMP_IN
  Top 0.406: SW1.3 81.66,49.78 81.53,49.4 R21.1
  Bottom 0.406: SW1.3 83.82,47.75 83.82,39.88 84.96,38.73 94.61,38.73 96.39,36.96 96.39,34.29 95.89,33.78 91.82,33.78 89.92,35.69 U1.5
ANALOG_3_ADC  (via drill 0.46)
  Top 0.305: 49.02,40.13 C6.1 49.12,40.41 46.23,43.31 R8.2 | 49.02,40.13 48.77,40.64 | 49.02,40.13 D22.C 55.37,43.69 D7.A | v43.18,45.47 43.18,43.69 R7.2 43.56,43.3 43.57,43.31 45.85,43.31 45.85,43.44 R8.2 | R8.2 45.72,43.3
  Bottom 0.305: v43.18,45.47 44.45,46.74 44.45,50.04 43.03,51.46 36.8,51.46 CPU_MODULE.PA19
ANALOG_3_ENABLE_CAP
  Top 0.406: 92.71,52.32 C23.1 92.48,52.68 92.46,52.7 92.08,52.32 SW1.7
ANALOG_3_IN  (via drill 0.46)
  Top 0.305: C5.1 40.39,40.13 40.51,40.26 R7.1 40.51,43.81 v39.24,45.09 39.12,45.21
  Bottom 0.406: X1.9 52.86,60.99 47.62,55.75 47.62,46.86 44.45,43.69 40.77,43.69 v39.24,45.09
ANALOG_3_OPAMP_IN
  Top 0.406: R27.1 81.41,52.45 SW1.2
  Bottom 0.406: SW1.2 84.07,52.32 87,49.4 87,46.61 90.17,43.43 U1.10
ANALOG_4_ADC  (via drill 0.46)
  Top 0.305: C8.1 49.02,32.77 | 49.02,32.77 D21.C 55.49,36.44 D8.A v56.39,37.97 | R10.1 45.97,36.58 | R10.1 R9.2 | 49.02,32.77 49.28,33.15 46.74,35.69 46.48,36.2 R10.1
  Bottom 0.305: CPU_MODULE.PA20 59,43.69 58.17,43.69 56.39,41.91 v56.39,37.97
ANALOG_4_ENABLE_CAP
  Top 0.406: 92.71,54.86 C24.1 92.48,55.4 91.95,54.86 SW1.8
ANALOG_4_IN  (via drill 0.46 pad 0.25)
  Top 0.305: R9.1 40.51,33.14 40.39,33.02 40.41,33 C7.1 40.44,32.77 40.54,32.87 v40.54,34.7 | R9.1 40.51,36.83 | R9.1 40.39,36.7 40.26,36.7
  Bottom 0.305: 48.26,55.37 48.26,40.64 42.32,34.7 v40.54,34.7
  Bottom 0.406: X1.10 56.4,69.35 53.59,66.55 53.59,60.71 48.26,55.37
ANALOG_4_OPAMP_IN
  Top 0.406: R30.1 81.15,55.5 SW1.1
  Bottom 0.406: SW1.1 79.88,52.96 79.88,51.82 80.64,51.05 83.57,51.05 85.09,49.53 U1.12 85.09,43.05
ANALOG_5_ADC  (via drill 0.46)
  Top 0.305: 43.31,29.33 R11.2 R12.2 46.1,29.08 49,26.19 C10.1 D20.C 51.82,25.91 55.37,29.46 D9.A v56.77,27.81
  Bottom 0.305: 57.02,27.56 61.09,27.56 62.61,26.04 62.61,22.23 62.1,21.72 61.47,21.72 60.71,22.48 58.17,22.48 57.28,21.59 57.28,15.11 58.29,14.1 59.44,13.59
  Bottom 0.406: 59.28,13.61 CPU_MODULE.AD4 59.44,13.59 59.44,13.46 | 57.02,27.56 v56.77,27.81
ANALOG_5_IN  (via drill 0.46 pad 0.25)
  Top 0.305: C9.1 40.41,26.14 40.39,26.16 40.51,26.29 R11.1 | 40.51,29.34 R11.1 | R11.1 40.39,29.33 40.39,29.34 40.26,29.34 | R11.1 40.54,29.21 v40.54,27.53
  Bottom 0.305: 49.02,33.91 49.02,33.78 42.77,27.53 v40.54,27.53
  Bottom 0.406: X1.11 59.84,71.78 54.36,66.29 54.36,60.45 49.02,55.12 49.02,33.91
ANALOG_6_ADC  (via drill 0.46)
  Top 0.305: 43.31,22.22 R13.2 R14.2 | D19.C C12.1 49,18.9 49.02,18.95 45.97,22 R14.2 | D10.A 55.49,22.22 52.07,18.8 D19.C | R14.2 46.23,22.35 | D19.C 51.82,18.03 v52.83,17.27
  Bottom 0.305: v52.83,17.27 53.21,17.27 54.36,16.13 54.36,14.73 58.04,11.05 59.44,11.05 CPU_MODULE.AD5
ANALOG_6_IN  (via drill 0.46)
  Top 0.305: C11.1 40.39,18.8 40.51,18.92 R13.1 40.51,22.86 v39.12,23.62
  Bottom 0.406: X1.12 63.38,73.29 | X1.12 63.5,73.66 | v39.12,23.62 45.59,23.62 49.78,27.81 49.78,53.34 56.64,60.2 56.64,65.02 63.25,71.63 63.25,73.66 X1.12
ANALOG_7_ADC  (via drill 0.46)
  Top 0.305: 43.31,15.36 R15.2 R16.2 | v53.21,11.96 D18.C | D18.C 51.69,11.81 51.82,11.68 55.63,15.49 D11.A | D18.C | v53.21,11.96 D18.C | R16.2 | R16.2 46.1,15.12 49.02,12.19 49,12.17 C14.1 49.02,11.94 49.05,11.96 v53.21,11.96
  Bottom 0.305: CPU_MODULE.AD6 59.03,8.53 58.8,8.76 58.55,8.76 55.35,11.96 v53.21,11.96
ANALOG_7_IN  (via drill 0.46)
  Top 0.305: C13.1 40.39,11.94 40.51,12.06 R15.1 40.26,15.62 v41.15,16.89
  Bottom 0.406: 66.55,73.66 X1.13 66.8,73.58 66.8,73.41 64.52,71.12 63.75,71.12 57.4,64.77 57.4,59.94 50.55,53.09 50.55,22.1 45.47,16.89 v41.15,16.89
ANALOG_OUT_1_PWM  (via drill 0.46)
  Top 0.305: 75.82,46.48 73.38,49.17 73.38,55.88 72.54,56.72 60.27,56.72
  Top 0.406: 75.82,46.48 R24.2 | v60.25,56.62 60.27,56.72
  Bottom 0.305: v60.25,56.62 60.25,56.72 60.2,56.77 54.71,51.28 54.71,38 56.13,36.58 56.9,36.58 57.91,37.59 60.71,37.59 61.98,36.32 61.98,30.99 61.21,30.23 57.4,30.23 55.37,28.19 55.37,25.65 45.72,16 40.77,16 39.62,17.14 39.62,19.18 37.72,21.08 36.58,21.08 36.58,21.21 CPU_MODULE.PA7 36.52,21.21
ANALOG_OUT_2_PWM  (via drill 0.46)
  Top 0.305: v61.72,57.53 62.1,57.53 62.36,57.28 72.77,57.28 73.91,56.13 73.91,51.05 74.93,50.04 75.95,50.04
  Top 0.406: 75.95,49.78 R21.2 75.95,50.04 75.18,49.78
  Bottom 0.305: v61.72,57.53 59.94,57.53 54.1,51.69 54.1,37.34 56.39,35.05 58.17,35.05 59.44,36.32
  Bottom 0.406: 59.44,36.32 59.41,36.35 CPU_MODULE.PA23
ANALOG_OUT_3_PWM  (via drill 0.46)
  Top 0.305: v60.2,58.42 62.1,58.42 62.74,57.78 73.03,57.78 74.42,56.39 74.42,53.85 75.69,52.58
  Top 0.406: 75.95,52.32 R27.2 75.95,52.58 75.69,52.58
  Bottom 0.305: CPU_MODULE.PA24 56.24,33.93 53.34,36.83 53.34,51.82 59.94,58.42
  Bottom 0.406: 59.94,58.42 v60.2,58.42
ANALOG_OUT_4_PWM  (via drill 0.46)
  Top 0.305: v62.48,59.31 62.48,58.93 63.12,58.29 73.28,58.29 75.69,55.88
  Top 0.406: 75.95,54.86 R30.2 75.82,55.75 75.69,55.88
  Bottom 0.305: 52.58,36.32 52.58,52.07 59.82,59.31 v62.48,59.31
  Bottom 0.406: CPU_MODULE.PA25 57.51,31.39 52.58,36.32
BATT_VOLTAGE_ADC  (via drill 0.46)
  Top 0.305: R1.2 R2.1 68.07,17.78 v68.07,16 | R1.2 68.2,21.08 | 68.2,20.83 R1.2
  Bottom 0.305: CPU_MODULE.AD7 59.41,6.07 59.44,6.1 61.72,6.1 62.23,5.59 70.61,5.59 73.91,8.89 73.91,12.95 71.12,15.75 68.33,15.75 v68.07,16
FREQ_1_IN
  Top 0.61: D26.A 23.62,68.07 24.84,69.29 X1.1
FREQ_1_IN_TIM  (via drill 0.46)
  Top 0.305: 18.54,51.31 18.29,51.31 | 19.05,50.55 U5.4 18.8,49.73 v17.48,48.41 | v32,17.78 v32,21.84
  Top 0.406: C42.1 22.1,57.15 18.8,53.85 18.8,51.56 18.54,51.31 U5.4
  Bottom 0.305: v32,21.84 31.88,22.1 31.24,22.73 31.24,33.15 29.21,35.18 28.45,35.18 24.51,39.12 21.21,39.12 20.7,38.61 9.65,38.61 8.51,39.75 8.51,41.27 12.32,45.09 12.32,45.47 14.99,48.13 17.2,48.13 v17.48,48.41 | CPU_MODULE.PA0 36.58,3.43 34.92,3.43 28.96,9.4 28.96,17.91 29.46,18.41 31.11,18.41 31.75,17.78 v32,17.78
FREQ_2_IN  (via drill 0.46)
  Top 0.305: v3.56,61.72 3.56,60.71 3.81,60.45
  Top 0.406: R18.1 3.81,57.15 3.81,60.45 3.81,60.48 C19.1
  Top 0.61: 3.81,60.45 C19.1
  Bottom 0.406: X1.2 28.45,73.66 28.45,76.71 26.92,78.23 6.1,78.23 3.17,75.31 3.17,62.1 v3.56,61.72
FREQ_2_IN_TIM  (via drill 0.46)
  Top 0.305: v29.72,23.75 v32.64,23.75 | C20.1 6.6,49.53 6.48,49.4 v6.48,47.88
  Top 0.406: R18.2 6.86,56.77 6.86,53.85 D12.C 6.6,53.47 6.6,50.29 C20.1
  Bottom 0.305: CPU_MODULE.PA15 36.68,41.55 38.99,39.24 38.99,26.42 37.59,25.02 33.91,25.02 v32.64,23.75 | v29.72,23.75 27.43,23.75 24.38,26.8 10.92,26.8 4.06,33.66 4.06,45.47 v6.48,47.88
FREQ_3_IN  (via drill 0.46)
  Top 0.305: 9.91,59.97 C31.1 | 9.91,60.2 v8.64,58.42
  Top 0.406: R32.1 9.91,57.15 9.91,59.97 9.91,60.2 9.91,60.68 C31.1 9.91,60.71 | X1.3 31.88,72.39 v29.21,69.72
  Bottom 0.406: v8.64,58.42 5.59,61.47 5.59,66.55 7.37,68.58 28.07,68.58 v29.21,69.72
FREQ_3_IN_TIM  (via drill 0.46)
  Top 0.305: v30.23,17.48 v30.23,21.79
  Top 0.406: R32.2 13.21,56.77 13.21,53.85 D14.C 12.95,53.47 12.95,50.29 | 12.95,50.29 C32.1 | v12.95,47.75 12.95,50.29
  Bottom 0.305: 59.56,28.7 61.47,28.7 63.12,27.05 63.12,21.59 62.74,21.21 62.74,17.27 62.48,17.02 62.48,10.41 61.85,9.78 58.42,9.78 55.24,12.95 52.83,12.95 49.78,9.65 34.8,9.65 30.23,14.73 v30.23,17.48 | v12.95,47.75 11.68,46.48 11.68,45.47 7.87,41.66 7.87,39.5 9.4,37.97 20.5,37.97 21.89,36.58 24.77,36.58 26.67,34.67 28.96,34.67 30.73,32.89 30.73,22.35 30.23,21.84 v30.23,21.79
  Bottom 0.406: 59.56,28.7 CPU_MODULE.PA26
GND  (via drill 1)
  other vias: 88.14,64.64
  pour Top: 0.51,79.5 99.57,79.5 99.57,0.76 0.51,0.76
  pour Top (no thermals): 75.95,60.2 80.42,60.2 80.42,57.1 75.84,57.1 75.84,60.2
GPI_1_IN  (via drill 0.46)
  Top 0.305: v36.07,67.31 JP1.3 | R33.1 6.6,41.91 6.99,41.53 v6.99,40.13
  Top 0.406: C33.1 6.6,46.46 6.6,42.8 R33.1 6.48,42.67 6.48,42.8
  Bottom 0.305: v36.07,67.31 36.07,64.01 29.97,58.04 24.38,58.04 20.07,53.72 20.07,50.16 19.18,49.28 11.68,49.28 11.05,48.64 11.05,45.72 6.99,41.66 v6.99,40.13
GPI_2_IN  (via drill 0.46)
  Top 0.305: 12.95,46.46 12.95,46.48
  Top 0.406: R34.1 12.95,42.93 v12.95,43.94 12.95,46.46 C35.1
  Bottom 0.305: JP2.3 43.69,67.31 45.21,65.79 45.21,64.26 44.45,63.5 36.45,63.5 30.35,57.4 24.64,57.4 20.7,53.47 20.7,49.78 17.91,46.99 14.99,46.99 13.21,45.21 13.21,44.32 12.95,44.07 v12.95,43.94
GPI_3_IN  (via drill 0.46)
  Top 0.305: JP3.3 45.85,67.31 44.58,66.04 37.85,66.04 36.58,64.77 36.58,62.48 | C37.1 19.3,45.72 20.07,46.48 v20.83,46.48
  Top 0.406: R35.1 19.05,42.67 19.28,42.9 C37.1 19.3,46.48 | v36.45,62.23 36.58,62.48
  Bottom 0.305: 36.2,62.1 30.86,56.77 25.02,56.77 21.34,53.09 21.34,46.99 v20.83,46.48
  Bottom 0.406: JP3.3 46.99,67.31 | 36.2,62.1 v36.45,62.23
GPIO_1
  Bottom 0.406: 35.56,73.66 35.43,73.66 X1.4 | 38.23,64.77 JP1.2
  Bottom 0.61: 38.23,64.77 37.08,65.91 37.08,70.36 35.43,72.01 35.43,73.66
GPIO_1_PIO  (via drill 0.46)
  Top 0.305: v33.88,22.71 34.14,22.84 33.66,22.61 33.66,20.19 v33.63,19.66 | 3.56,34.42 3.58,34.44 C34.1 3.56,34.54 3.56,27.94 v5.97,25.53
  Top 0.406: 3.3,40.64 3.3,38.86 D15.C 3.56,38.49 3.56,35.05 C34.1 | 3.3,40.64 3.3,42.29 R33.2 3.68,42.67 3.81,42.55 3.3,42.04 3.3,40.64
  Bottom 0.305: U4.2 24,50.55 27.18,47.37 27.18,40.36 28.17,39.37 32.51,39.37 33.91,40.77 33.91,44.32 34.92,45.34 37.59,45.34 38.39,44.54 | 38.39,44.54 38.48,44.45 | 38.39,44.54 38.41,44.55 39.62,43.33 39.62,26.04 37.34,23.75 36.7,23.75 36.58,23.88 36.55,23.85 CPU_MODULE.PA8 36.45,23.88 35.05,23.88 v33.88,22.71 | v33.63,19.66 32.89,20.19 29.21,20.19 23.88,25.53 v5.97,25.53
  Bottom 0.61: U4.2 U4.1
GPIO_2
  Bottom 0.406: 42.93,64.77 JP2.2 | X1.5 38.86,73.66 39.24,73.28
  Bottom 0.61: 42.93,64.77 41.15,66.55 41.15,70.36 39.24,72.26 39.24,73.28
GPIO_2_PIO  (via drill 0.46)
  Top 0.406: 9.65,38.35 D16.C | 9.65,38.35 v9.65,39.88 9.65,42.55 R34.2 | C36.1 9.93,35.16 9.65,35.43 9.65,38.35
  Bottom 0.305: CPU_MODULE.PA16 36.73,44.09 36.83,44.2 36.32,44.2 34.42,42.29 34.42,40.39 32.89,38.86 27.81,38.86 26.42,40.26 26.42,43.69 24.64,45.47 U4.4 14.99,45.47 14.22,44.7 14.22,42.93 13.34,41.91 11.68,41.91 v9.65,39.88
  Bottom 0.61: U4.4 23.88,45.47 23.62,45.72 U4.3
GPIO_3
  Bottom 0.406: 42.42,73.66 X1.6
  Bottom 0.61: JP3.2 45.21,66.8 45.21,70.87 42.42,73.66
GPIO_3_PIO  (via drill 0.46)
  Top 0.406: D17.C 16,38.98 v16,39.88 | v16,39.88 16,42.29 R35.2 16.26,42.54 | C38.1 16.26,35.05 16.26,38.49 D17.C | D17.C 16,38.86 v16,39.88
  Bottom 0.305: 59.44,26.29 59.18,26.29 57.02,26.29 46.1,15.37 40.39,15.37 38.99,16.76 38.99,18.8 37.85,19.94 35.43,19.94 33.53,21.84 33.27,21.84 31.75,23.37 31.75,33.4 33.15,34.8 33.15,35.94 32.51,36.58 28.7,36.58 24.89,40.39 U4.6 | U4.6 16.51,40.39 v16,39.88 | U4.6 24.38,40.39
  Bottom 0.406: U4.5 23.88,42.93 | 58.42,26.31 58.06,26.31 | 58.42,26.31 CPU_MODULE.PA27 59.44,26.29 | 23.67,40.31 23.55,40.06 | 59.18,26.29 58.42,26.31
  Bottom 0.61: U4.5 U4.6 23.67,40.31
GPO_1_OUT
  Top 0.61: JP1.1 40.64,62.23 41.91,63.5 44.58,63.5 45.21,64.14 45.21,65.41 45.85,66.04 48.77,66.04 50.55,67.82 R36.1
  Bottom 0.61: JP1.1 37.85,62.23 31.24,55.63 U4.16 | U4.16 31.24,52.58 | 31.24,50.04 U4.15 U4.16
GPO_2_OUT
  Top 0.61: R37.1 50.67,64.77 49.4,63.5 45.85,63.5 44.83,62.48 43.43,62.48 JP2.1
  Bottom 0.61: 31.24,45.21 U4.13 U4.14 31.5,47.75 33.27,49.53 33.27,55.37 37.85,59.94 39.88,59.94 42.16,62.23 JP2.1
GPO_3_OUT
  Top 0.61: R38.1 50.67,62.23 JP3.1
  Bottom 0.406: U4.12 31.24,43.18
  Bottom 0.61: 31.5,42.93 32.26,42.93 | 31.5,42.93 U4.12 | U4.11 31.24,42.67 31.5,42.93 | 31.24,43.18 32.77,43.18 33.15,43.56 33.15,47.12 34.54,48.51 34.54,54.86 38.35,58.67 41.15,58.67 44.7,58.67 47.24,61.21 JP3.1
MISO  (via drill 0.46 pad 0.25, 0.46 pad 0.81)
  Top 0.305: v28.78,30.86 v32.64,30.86 | X4.7 9.6,29.27 v9.78,29.34
  Bottom 0.305: CPU_MODULE.PA12 35.61,33.93 32.54,30.86 v32.64,30.86 | v28.78,30.86 28.83,30.86 27.94,31.75 24.38,31.75 20.57,27.94 11.18,27.94 v9.78,29.34 9.53,29.21 4.57,34.04 4.57,42.8 8.89,47.12 8.89,50.29 10.16,51.56 10.16,59.84 7.57,62.43 7.57,62.74 7.52,62.79 7.54,62.81 X5.P8
MOSI  (via drill 0.46 pad 0.25, 0.46 pad 0.81)
  Top 0.305: v28.32,32.64 v32.64,32.64 | v21.08,29.97 21.08,30.1 21.26,30.28 X4.2
  Bottom 0.305: CPU_MODULE.PA13 36.22,36.47 34.29,34.54 34.29,33.78 33.12,32.61 32.56,32.61 32.51,32.66 | 32.51,32.66 32.46,32.72 | v32.64,32.64 32.51,32.66 | v28.32,32.64 28.35,32.66 28.45,32.66 28.19,32.92 23.9,32.92 22.1,31.11 v21.08,29.97 19.81,28.7 11.68,28.7 9.65,30.73 8.89,30.73 5.08,34.54 5.08,42.42 9.4,46.74 9.4,49.91 10.79,51.31 10.79,59.94 12.7,61.85 12.7,62.74 12.65,62.79 X5.P4
N$3
  Top 0.406: R46.2 33.66,67.69 30.48,64.52 D27.C R47.1
N$4
  Top 0.61: 30.73,68.07 R46.1 D26.C
N$5
  Top 1.016: D5.A 92.21,60.7 92.18,60.72 D4.A
N$6
  Top 0.406: R47.2 23.88,64.52 27.18,61.21 D25.C C41.1
N$7
  Top 0.305: R41.1 49.28,8.51 LED3.C
N$8  (via drill 0.46)
  Top 0.406: R19.2 70.99,46.74 71.37,46.35 v72.77,46.35
  Bottom 0.406: v72.77,46.35 76.96,42.16 76.96,39.88 79.5,37.34 80.77,37.34 81.28,36.83 81.28,33.91 82.04,33.15 87.63,33.15 88.9,34.42 88.9,36.83 89.53,37.47 91.19,37.47 92.84,35.81 92.84,35.43 U1.6
N$9
  Top 0.305: R40.1 43.31,6.23 LED2.C
N$10  (via drill 0.46)
  Top 0.406: 65.53,46.86 R22.2 | v78.23,36.32 78.36,36.32 79.5,37.47 81.28,37.47 82.17,36.58 82.17,35.94 U1.2 | R22.2 65.66,46.86 | v64.77,44.83 65.66,45.72 R22.2
  Bottom 0.406: U1.2 82.42,35.56 | v78.23,36.32 72.14,42.42 66.55,42.42 64.77,44.2 v64.77,44.83
N$12  (via drill 0.46)
  Top 0.406: R25.2 65.28,35.31 65.28,33.4 66.42,32.26 71.75,32.26 78.61,39.12 84.58,39.12 v85.34,39.88
  Bottom 0.406: v85.34,39.88 91.19,39.88 92.71,41.4 U1.9
N$14
  Top 0.406: R28.2 71,35.44 71.12,35.56 | R28.2 70.99,35.31 71.12,35.43 71.25,35.43 | 71.25,35.43 72.01,35.43 | U1.13 82.55,42.55 80.64,40.64 77.85,40.64 72.64,35.43 71.25,35.43 | 71.25,35.43 R28.2
N$15
  Top 0.406: D25.A 20.57,61.47 18.54,59.44 18.54,59.18 U5.1
N$16
  Top 0.406: C25.1 78.49,17.78 77.47,18.8 U2.1
N$17
  Top 0.406: C25.2 81.53,17.78 82.55,18.8 U2.3
N$18
  Top 0.406: C26.1 85.09,19.05 U2.4
N$19
  Top 0.406: C26.2 87.63,19.05 U2.5
N$20
  Top 0.406: U2.2 80.01,22.61 78.74,23.88 74.17,23.88 C27.2
N$21
  Top 0.406: C28.1 90.17,19.05 U2.6
N$22
  Top 0.305: R31.1 55.88,8.13 LED1.C
NPCS0  (via drill 0.46 pad 0.25)
  Top 0.305: v28.85,29.08 v32.64,29.08 | v24.66,30.1 24.77,30.1 24.53,30.34 X4.1
  Bottom 0.305: CPU_MODULE.PA11 36.58,31.37 34.8,31.37 v32.64,29.08 | v24.66,30.1 25.65,31.09 27.08,31.09 28.7,29.46 28.68,29.44 v28.85,29.08
NPCS1  (via drill 0.46)
  Top 0.305: v29.79,25.58 v32.54,25.58
  Bottom 0.305: 36.58,26.29 CPU_MODULE.PA9 36.2,26.67 36.22,26.7 36.22,26.72 33.53,26.72 v32.54,25.58 32.61,25.63 | v29.79,25.58 29.79,25.76 30.23,26.31 30.23,32.64 28.7,34.16 20.95,34.16 17.78,37.34 7.49,37.34 6.1,38.73 6.1,41.66 10.41,45.97 10.41,49.15 12.19,50.93 12.19,59.05 15.19,62.05 X5.P2
RXD0  (via drill 0.46)
  Top 0.305: v61.72,22.86 v64.14,22.86
  Bottom 0.305: CPU_MODULE.PA5 37.69,16.15 39.75,14.1 46.61,14.1 57.3,24.79 60.63,24.79 61.72,23.7 v61.72,22.86 61.59,22.99 | U2.12 87.63,29.97 86.61,30.99 72.01,30.99 65.02,24 65.28,24 v64.14,22.86
RXD0_JACK
  Bottom 0.305: U2.13 85.09,26.92 83.31,25.15 73.15,25.15 71.88,23.88 71.88,19.56 73.15,18.29 76.2,18.29 79.45,15.04 X3.P1-2
  Bottom 0.406: U2.13 85.09,29.46
RXD1
  Bottom 0.305: CPU_MODULE.PA21 61.72,39.24 65.53,39.24 72.26,32.51 92.84,32.51 95.38,29.97
  Bottom 0.406: U2.9 95.38,28.96 95.38,29.97
RXD1_JACK
  Bottom 0.305: 95.25,21.59 U2.8 90.37,16.46 X3.P2-2
SAFE12V  (via drill 0.46, 0.6, 1)
  Top 0.406: C30.1 87.63,32.26 87.63,35.31 | 96.01,39.88 v96.9,39.88 97.54,39.24 97.54,27.18 v96.01,25.65 | R1.1 71.02,20.83 v73.79,20.83
  Top 0.61: R36.2 R37.2 R38.2
  Top 0.813: U4.9 29.97,35.31 28.45,36.83 v28.45,40.39 | 53.85,67.94 53.98,67.95 | 53.98,67.95 R36.2 | v54.61,69.6 53.98,68.96 53.98,67.95 | U3.1 81.86,63.37 v83.19,62.1 | v96.9,39.88 90.42,39.88 87.63,37.08 87.63,35.31 U1.4 | D3.C 79.01,68.96 v78.49,69.47 | 54.61,76.45 v54.48,76.33 55.12,76.45 67.82,76.45 68.33,76.96 v71.75,76.96 | v29.21,54.99 v29.21,59.05
  Top 1.27: C1.+ 86.33,67.09 86.36,67.06 87.12,67.82 | 80.01,68.07 80.99,67.09 | D3.C 80.01,68.07 | U3.1 80.42,67.67 80.01,68.07 | 84.33,67.09 C1.+ | C1.+ 86.23,67.06
  Top 1.778: 87.12,67.82 D2.C | 80.99,67.09 84.33,67.09 v84.33,64.64
  Bottom 0.406: 96.77,39.88 v96.9,39.88 97.03,39.88 | v73.79,20.83 76.83,23.88 94.23,23.88 v96.01,25.65
  Bottom 0.813: v96.9,39.88 97.41,40.39 97.41,54.61 89.92,62.1 v83.19,62.1 | v78.49,69.47 75.69,72.26 75.69,75.44 74.17,76.96 v71.75,76.96 | v29.21,59.05 34.8,64.64 34.8,70.61 33.66,71.75 33.66,75.18 34.8,76.33 v54.48,76.33 54.61,76.2 v54.61,69.6 | v29.21,54.99 29.21,55.12 28.45,54.1 v28.45,40.39
SD_CARD_DETECT  (via drill 0.46)
  Top 0.305: v63.63,20.32 v61.85,20.32 | v27.94,10.67 v29.84,10.67 | v9.53,18.41 9.53,27.43 6.6,30.35 X4.CDI | X4.CDI 6.73,31.88 | X4.CDI
  Bottom 0.305: CPU_MODULE.PA29 59.44,21.21 60.83,21.21 v61.85,20.32 | v63.63,20.32 63.5,20.32 63.5,17.02 63.25,16.76 63.25,9.91 60.71,7.37 57.66,7.37 56.39,8.64 39.12,8.64 37.72,7.24 33.27,7.24 v29.84,10.67 | v27.94,10.67 27.94,12.7 22.23,18.41 v9.53,18.41
SD_WRITE_PROTECT  (via drill 0.46)
  Top 0.305: X4.WP 5.34,31.76 5.33,31.5 v5.08,30.23
  Bottom 0.305: CPU_MODULE.PA28 57.17,23.77 46.86,13.46 39.37,13.46 37.97,14.86 35.43,14.86 34.8,15.49 34.8,19.81 33.78,20.83 29.46,20.83 24.13,26.16 10.79,26.16 6.6,30.35 5.21,30.35 v5.08,30.23
SPCK  (via drill 0.46 pad 0.25, 0.46 pad 0.81)
  Top 0.305: v29.29,27.38 v32.66,27.38 | X4.5 14.53,29.64 v14.48,29.59
  Bottom 0.305: CPU_MODULE.PA14 36.93,39.01 38.41,37.54 38.41,28.35 37.69,27.64 32.92,27.64 v32.66,27.38 | v29.29,27.38 29.67,27.51 29.67,32.46 28.52,33.6 22.81,33.6 18.54,29.59 v14.48,29.59 12.06,29.59 10.29,31.37 9.27,31.37 5.59,35.05 5.59,42.04 9.91,46.35 9.91,49.53 11.43,51.05 11.43,59.44 13.89,61.9 13.89,65.41 13.92,65.43 X5.P3
STATUS_LED_1-1  (via drill 0.46)
  Top 0.305: R41.2 45.97,8.89 45.97,8.38 v45.34,7.24
  Bottom 0.305: v45.34,7.24 45.34,7.37 44.45,8.13 39.62,8.13 37.57,6.07 CPU_MODULE.PA1
STATUS_LED_1-2
  Top 0.305: R40.2 40.16,8.53 CPU_MODULE.PA2
TXD0  (via drill 0.46)
  Top 0.305: v61.72,25.15 v64.14,25.15
  Bottom 0.305: CPU_MODULE.PA6 37.95,18.69 38.35,18.29 38.35,16.51 40.13,14.73 46.35,14.73 56.92,25.3 61.54,25.3 61.54,25.2 v61.72,25.15 | U2.11 90.17,29.97 88.77,31.5 71.63,31.5 65.28,25.15 v64.14,25.15
TXD0_JACK
  Bottom 0.305: U2.14 82.55,26.92 81.79,26.16 72.64,26.16 70.87,24.38 70.87,19.05 72.64,17.27 75.44,17.27 78.18,14.53 X3.P1-1 | X3.P1-1 78.11,8.18 | X3.P1-1 78.18,8.08
TXD1
  Bottom 0.305: 59.82,38.61 65.41,38.61 72.01,32 90.55,32 92.71,29.84 U2.10
  Bottom 0.406: CPU_MODULE.PA22 59.82,38.61
TXD1_JACK
  Bottom 0.305: U2.7 92.2,20.83 92.2,20.19 89.05,17.04 89.05,8.08 X3.P2-1
VREF  (via drill 0.6)
  Top 0.61: C39.1 67.31,65.02 67.19,65.15 L1.2 63.88,65.28 | 63.75,65.28 61.72,65.28 59.69,67.31
  Top 0.813: C39.1 67.29,65 67.31,65.02 v68.83,65.02
  Top 1.27: 63.75,65.28 L1.2 | C40.+ 59.69,67.31
  Bottom 0.61: X1.14 70.38,72.54
  Bottom 0.813: X1.14 70.61,73.66 70.36,73.41 70.36,66.29 v68.83,65.02

### Text on the board
tPlace: INPUT | + | OUTPUT | DIGITAL | ANALOG | www.autosportlabs.net | Copyright 2008 | Autosport Labs | Race Datalogger Rev A